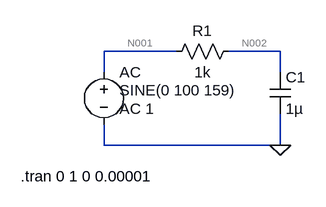
[diagram p0: schematic RC_volatge_charaacteristics.asc]
RC_volatge_charaacteristics.asc, the LTspice schematic file:
Version 4
SHEET 1 880 680
WIRE 112 96 0 96
WIRE 272 96 192 96
WIRE 0 128 0 96
WIRE 272 128 272 96
WIRE 0 240 0 208
WIRE 272 240 272 192
WIRE 272 240 0 240
FLAG 272 240 0
SYMBOL res 208 80 R90
WINDOW 0 0 56 VBottom 2
WINDOW 3 32 56 VTop 2
SYMATTR InstName R1
SYMATTR Value 1k
SYMBOL cap 256 128 R0
SYMATTR InstName C1
SYMATTR Value 1µ
SYMBOL voltage 0 112 R0
WINDOW 123 24 72 Left 2
WINDOW 39 0 0 Left 2
WINDOW 3 24 44 Left 2
SYMATTR Value2 AC 1
SYMATTR InstName AC
SYMATTR Value SINE(0 100 159)
TEXT -128 288 Left 2 !.tran 0 1 0 0.00001

The netlist it stands for:
* RC_volatge_charaacteristics.asc
R1 N002 N001 1k
C1 N002 0 1µ
V§AC N001 0 SINE(0 100 159) AC 1
.tran 0 1 0 0.00001
.backanno
.end

* Results of the author's LTspice run, read from the files saved beside the schematic
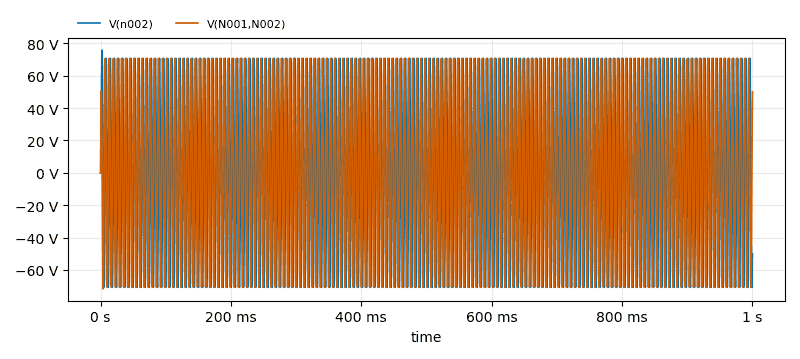
[diagram p1: Transient Analysis of RC_volatge_charaacteristics.asc, plotted from the saved traces]
* Transient Analysis, 1 run:
*   V(n002): min -70.74 V, max 75.64 V, average 50.06 mV, rms 50.03 V, last -50 V
*   V(N001,N002): min -71.62 V, max 70.67 V, average -49.91 mV, rms 49.94 V, last 50 V